# EAGLE design CubePCB_partitionedWithDIP (EAGLE 9.2.2)
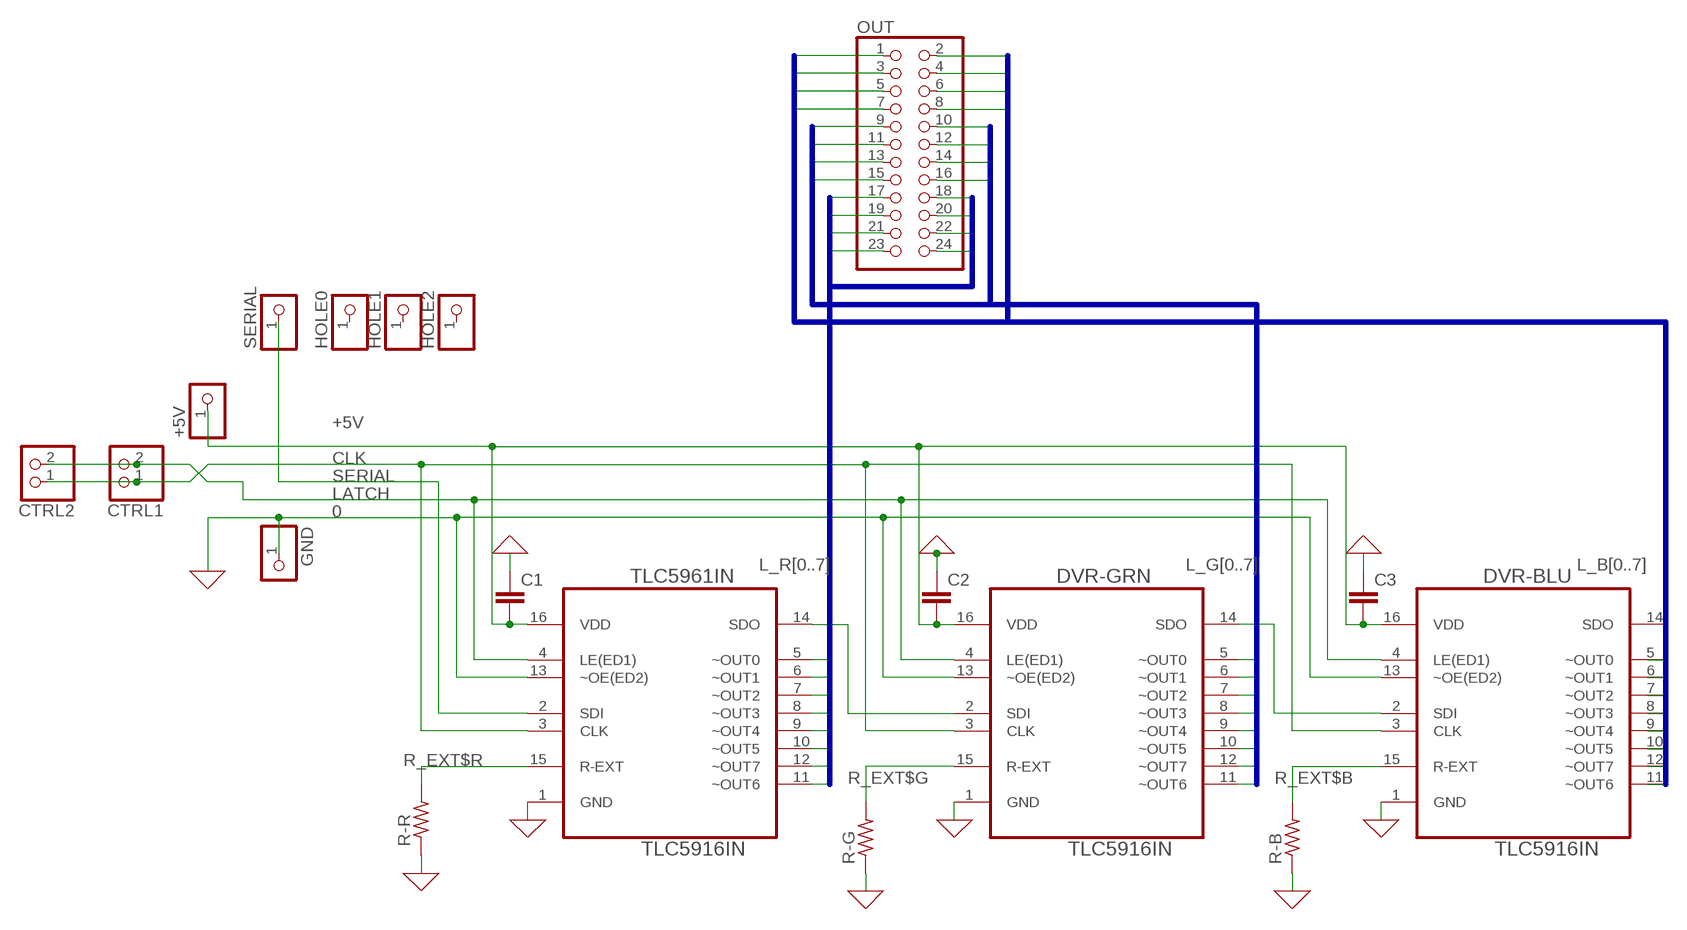
[diagram p0: schematic, sheet 1]

## Parts
+5V  PINHD-1X1  [1X01]
C1  C2,5-3  [C2.5-3]
C2  C2,5-3  [C2.5-3]
C3  C2,5-3  [C2.5-3]
CTRL1  PINHD-1X2  [1X02]
CTRL2  PINHD-1X2  [1X02]
DVR-BLU  TLC5916IN  [DIP254P762X508-16]
DVR-GRN  TLC5916IN  [DIP254P762X508-16]
GND  PINHD-1X1  [1X01]
HOLE0  PINHD-1X1  [1X01]
HOLE1  PINHD-1X1  [1X01]
HOLE2  PINHD-1X1  [1X01]
OUT  PINHD-2X12  [2X12]
R-B  R-US_0204/7  [0204/7]
R-G  R-US_0204/7  [0204/7]
R-R  R-US_0204/7  [0204/7]
SERIAL  PINHD-1X1  [1X01]
TLC5961IN  TLC5916IN  [DIP254P762X508-16]

## Nets
0: C1.1 C2.1 C3.1 DVR-BLU.1(GND) DVR-BLU.13(~OE(ED2)) DVR-GRN.1(GND) DVR-GRN.13(~OE(ED2)) GND.1 R-B.1 R-G.1 R-R.1 TLC5961IN.1(GND) TLC5961IN.13(~OE(ED2)) ; supply symbol labelled GND
+5V: +5V.1 C1.2 C2.2 C3.2 DVR-BLU.16(VDD) DVR-GRN.16(VDD) TLC5961IN.16(VDD)
CLK: CTRL1.1 CTRL2.1 DVR-BLU.3(CLK) DVR-GRN.3(CLK) TLC5961IN.3(CLK)
L_B0: DVR-BLU.5(~OUT0) OUT.7
L_B1: DVR-BLU.6(~OUT1) OUT.8
L_B2: DVR-BLU.7(~OUT2) OUT.5
L_B3: DVR-BLU.8(~OUT3) OUT.6
L_B4: DVR-BLU.9(~OUT4) OUT.3
L_B5: DVR-BLU.10(~OUT5) OUT.4
L_B6: DVR-BLU.12(~OUT7) OUT.1
L_B7: DVR-BLU.11(~OUT6) OUT.2
L_G0: DVR-GRN.5(~OUT0) OUT.15
L_G1: DVR-GRN.6(~OUT1) OUT.16
L_G2: DVR-GRN.7(~OUT2) OUT.13
L_G3: DVR-GRN.8(~OUT3) OUT.14
L_G4: DVR-GRN.9(~OUT4) OUT.11
L_G5: DVR-GRN.10(~OUT5) OUT.12
L_G6: DVR-GRN.12(~OUT7) OUT.9
L_G7: DVR-GRN.11(~OUT6) OUT.10
L_R0: OUT.23 TLC5961IN.5(~OUT0)
L_R1: OUT.24 TLC5961IN.6(~OUT1)
L_R2: OUT.21 TLC5961IN.7(~OUT2)
L_R3: OUT.22 TLC5961IN.8(~OUT3)
L_R4: OUT.19 TLC5961IN.9(~OUT4)
L_R5: OUT.20 TLC5961IN.10(~OUT5)
L_R6: OUT.17 TLC5961IN.12(~OUT7)
L_R7: OUT.18 TLC5961IN.11(~OUT6)
LATCH: CTRL1.2 CTRL2.2 DVR-BLU.4(LE(ED1)) DVR-GRN.4(LE(ED1)) TLC5961IN.4(LE(ED1))
N$1: DVR-GRN.2(SDI) TLC5961IN.14(SDO)
N$2: DVR-BLU.2(SDI) DVR-GRN.14(SDO)
R_EXT$B: DVR-BLU.15(R-EXT) R-B.2
R_EXT$G: DVR-GRN.15(R-EXT) R-G.2
R_EXT$R: R-R.2 TLC5961IN.15(R-EXT)
SERIAL: SERIAL.1 TLC5961IN.2(SDI)
Unconnected: DVR-BLU.14(SDO) HOLE0.1 HOLE1.1 HOLE2.1

## Buses
L_R[0..7]
L_G[0..7]
L_B[0..7]

## Library data of the parts
+5V GND HOLE0 HOLE1 HOLE2 SERIAL = pinhead:PINHD-1X1: PIN HEADER
C1-C3 = capacitor-wima:C: CAPACITOR naming: grid - package width
CTRL1 CTRL2 = pinhead:PINHD-1X2: PIN HEADER
DVR-BLU DVR-GRN TLC5961IN = Texas Instruments_By_element14_Batch_1:TLC5916IN: 8-CHANNEL CONSTANT-CURRENT LED SINK DRIVERS; MPN: TLC5916IN; OC_FARNELL: 1647814; OC_NEWARK: 60M1749; PACKAGE: PDIP-16; SUPPLIER: Texas Instruments
OUT = pinhead:PINHD-2X12: PIN HEADER
R-B R-G R-R = rcl:R-US_: RESISTOR, American symbol; SPICEPREFIX: R

## Module SLICE
Ports: +5V(io) SERIAL(io) CLK(io) LATCH(io) 0(io) ~OUT_EN(io)

### Library data of the parts

## Board
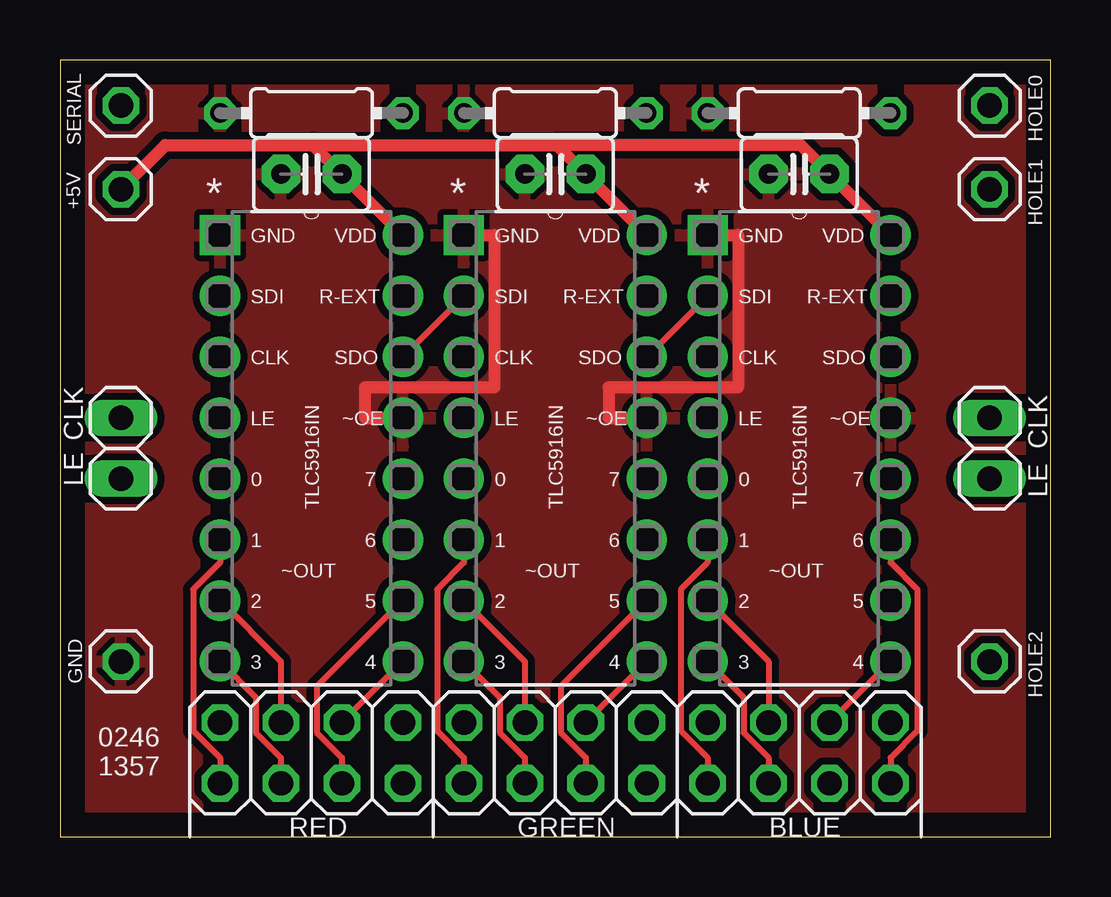
[diagram p1: board, top side]
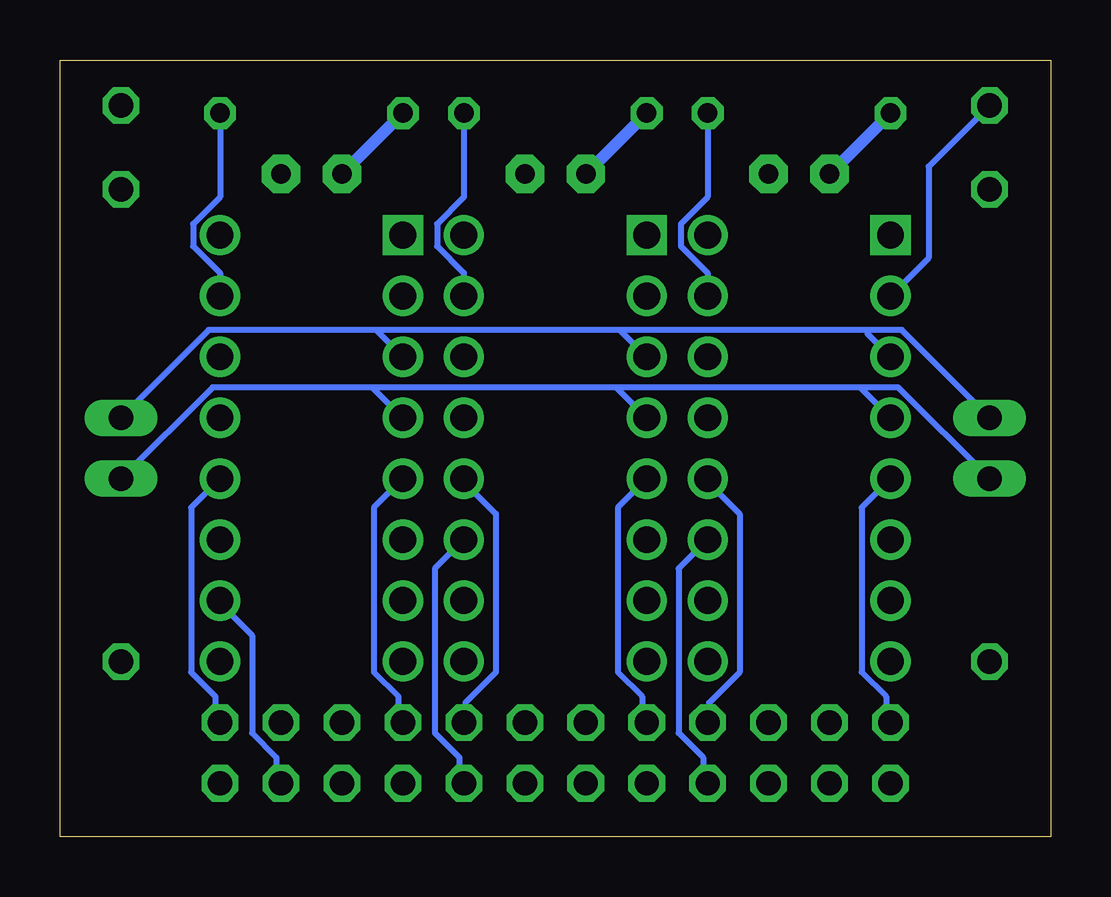
[diagram p2: board, bottom side, seen from below]

Size 41.27 x 32.38 mm. Coordinates in mm from the lower left corner, seen from the top.
Outline: 0,0 41.27,0.01 41.27,32.38 0,32.38 0,0
Copper layers (1*16): Top 0.035mm / dielectric 1.5mm / Bottom 0.035mm
Design rules "default *": minimum track width 10mil, minimum drill 0.35mm, track to track 10mil, track to pad 6mil, pad to pad 6mil, via to via 6mil, smd to smd 6mil, copper to edge 40mil, drill to drill 6mil, minimum pad ring 10mil, minimum via ring 8mil, stop-mask expansion 4mil, vias tented up to drill 0mil, thermal gap 10mil

### Footprints (pad centres in the part's own frame; a part is rotated, then mirrored left to right if it is on the bottom)
1X01 = drill 1.016 octagon: 1 0,0
C2.5-3 = drill 0.813 pad 1.6 octagon: 1 -1.27,0; 2 1.27,0
1X02 = drill 1.016 long: 1 -1.27,0; 2 1.27,0
DIP254P762X508-16 = drill 1.118 square: 1 -7.62,17.78 | drill 1.118: 2 -7.62,15.24; 3 -7.62,12.7; 4 -7.62,10.16; 5 -7.62,7.62; 6 -7.62,5.08; 7 -7.62,2.54; 8 -7.62,0; 9 0,0; 10 0,2.54; 11 0,5.08; 12 0,7.62; 13 0,10.16; 14 0,12.7; 15 0,15.24; 16 0,17.78
2X12 = drill 1.016 octagon: 1 -13.97,-1.27; 2 -13.97,1.27; 3 -11.43,-1.27; 4 -11.43,1.27; 5 -8.89,-1.27; 6 -8.89,1.27; 7 -6.35,-1.27; 8 -6.35,1.27; 9 -3.81,-1.27; 10 -3.81,1.27; 11 -1.27,-1.27; 12 -1.27,1.27; 13 1.27,-1.27; 14 1.27,1.27; 15 3.81,-1.27; 16 3.81,1.27; 17 6.35,-1.27; 18 6.35,1.27; 19 8.89,-1.27; 20 8.89,1.27; 21 11.43,-1.27; 22 11.43,1.27; 23 13.97,-1.27; 24 13.97,1.27
0204/7 = drill 0.813 octagon: 1 -3.81,0; 2 3.81,0

### Placement (x,y rotation side)
+5V  2.54,26.99 0 top
C1  10.48,27.62 0 top
C2  20.64,27.62 0 top
C3  30.8,27.62 0 top
CTRL1  2.54,16.19 270 top
CTRL2  38.73,16.19 270 top
DVR-BLU  34.61,7.3 0 top
DVR-GRN  24.45,7.3 0 top
GND  2.54,7.3 0 top
HOLE0  38.73,30.48 0 top
HOLE1  38.73,26.99 0 top
HOLE2  38.73,7.3 0 top
OUT  20.64,3.49 180 top
R-B  30.8,30.16 0 top
R-G  20.64,30.16 0 top
R-R  10.48,30.16 0 top
SERIAL  2.54,30.48 0 top
TLC5961IN  14.29,7.3 0 top

### Tracks (layer width: path | path; a pad name or v marks a point on that pad's centre or on a via)
0
  Top 0.508: TLC5961IN.13 12.7,17.46 12.7,18.73 18.1,18.73 18.1,25.08 DVR-GRN.1 | DVR-GRN.13 22.86,17.46 22.86,18.73 28.26,18.73 28.26,25.08 DVR-BLU.1
  Bottom 0.508: R-R.1 C1.1 | R-G.1 C2.1 | C3.1 R-B.1
  pour Top (isolate 0.305): 0,0 0,32.38 41.27,32.38 41.27,0
+5V
  Top 0.508: TLC5961IN.16 C1.2 10.54,28.83 | DVR-GRN.16 C2.2 20.7,28.83 | DVR-BLU.16 C3.2 30.86,28.83 20.7,28.83 | 10.54,28.83 4.38,28.83 +5V.1 | 10.54,28.83 20.7,28.83
CLK
  Bottom 0.254: 7.62,21.12 6.2,21.12 CTRL1.1 | 7.62,21.12 17.95,21.12 | 17.95,21.12 28.11,21.12 | CTRL2.1 35.08,21.12 28.26,21.12 28.11,21.12 | TLC5961IN.3 7.62,20.95 7.62,21.12 | DVR-GRN.3 17.95,21.12 | DVR-BLU.3 28.11,21.12
L_B0
  Bottom 0.254: DVR-BLU.5 28.19,13.72 28.19,6.86 27.18,5.84 27.18,4.83 OUT.7
L_B1
  Top 0.254: DVR-BLU.6 26.99,11.42 25.87,10.3 25.87,4.41 26.99,3.29 OUT.8
L_B2
  Top 0.254: DVR-BLU.7 29.53,7.3 OUT.5
L_B3
  Top 0.254: DVR-BLU.8 28.49,5.8 28.49,4.33 29.53,3.29 OUT.6
L_B4
  Top 0.254: OUT.3 DVR-BLU.9
L_B5
  Bottom 0.254: OUT.4 32.26,2.29 32.26,3.3 33.27,4.32 33.27,8.38 34.54,9.65 DVR-BLU.10
L_B6
  Bottom 0.254: DVR-BLU.12 35.81,13.72 35.81,6.86 34.8,5.84 34.8,4.83 OUT.1
L_B7
  Top 0.254: DVR-BLU.11 34.61,11.42 35.73,10.3 35.73,4.41 34.61,3.29 OUT.2
L_G0
  Bottom 0.254: DVR-GRN.5 18.03,13.72 18.03,6.86 17.02,5.84 17.02,4.83 OUT.15
L_G1
  Top 0.254: DVR-GRN.6 16.83,11.42 15.71,10.3 15.71,4.41 16.83,3.29 OUT.16
L_G2
  Top 0.254: DVR-GRN.7 19.37,7.3 OUT.13
L_G3
  Top 0.254: DVR-GRN.8 18.33,5.8 18.33,4.33 19.37,3.29 OUT.14
L_G4
  Top 0.254: DVR-GRN.9 OUT.11
L_G5
  Top 0.254: OUT.12 21.91,3.29 20.87,4.33 20.87,6.26 DVR-GRN.10
L_G6
  Bottom 0.254: OUT.9 24.38,4.83 24.38,5.59 23.11,6.86 23.11,13.46 24.38,14.73 DVR-GRN.12
L_G7
  Bottom 0.254: DVR-GRN.11 25.65,11.18 25.65,4.32 24.64,3.3 24.64,2.29 OUT.10
L_R0
  Bottom 0.254: TLC5961IN.5 7.87,13.72 7.87,6.86 6.86,5.84 6.86,4.83 OUT.23
L_R1
  Top 0.254: TLC5961IN.6 6.67,11.42 5.55,10.3 5.55,4.41 6.67,3.29 OUT.24
L_R2
  Top 0.254: TLC5961IN.7 9.21,7.3 OUT.21
L_R3
  Top 0.254: TLC5961IN.8 8.17,5.8 8.17,4.33 9.21,3.29 OUT.22
L_R4
  Top 0.254: TLC5961IN.9 OUT.19
L_R5
  Top 0.254: OUT.20 11.75,3.29 10.71,4.33 10.71,6.26 TLC5961IN.10
L_R6
  Bottom 0.254: OUT.17 14.22,4.83 14.22,5.59 12.95,6.86 12.95,13.46 14.22,14.73 TLC5961IN.12
L_R7
  Bottom 0.254: TLC5961IN.11 15.49,11.18 15.49,4.32 14.48,3.3 14.48,2.29 OUT.18
LATCH
  Bottom 0.254: 7.94,18.73 6.35,18.73 CTRL1.2 | 7.94,18.73 18.1,18.73 | 18.1,18.73 28.26,18.73 | 28.26,18.73 34.92,18.73 CTRL2.2 | TLC5961IN.4 7.94,18.73 | DVR-GRN.4 18.1,18.73 | DVR-BLU.4 28.26,18.73
N$1
  Top 0.254: TLC5961IN.14 DVR-GRN.2
N$2
  Top 0.254: DVR-GRN.14 DVR-BLU.2
R_EXT$B
  Bottom 0.254: R-B.2 34.61,26.66 35.73,25.55 35.73,24.62 34.61,23.5 DVR-BLU.15
R_EXT$G
  Bottom 0.254: R-G.2 24.45,26.66 25.57,25.55 25.57,24.62 24.45,23.5 DVR-GRN.15
R_EXT$R
  Bottom 0.254: R-R.2 14.29,26.66 15.4,25.55 15.4,24.62 14.29,23.5 TLC5961IN.15
SERIAL
  Bottom 0.254: SERIAL.1 5.08,27.94 5.08,24.13 TLC5961IN.2

### Text on the board
tPlace: GND | VDD | GND | VDD | GND | VDD | SDI | R-EXT | SDI | R-EXT | SDI | R-EXT | CLK | SDO | CLK | SDO | CLK | SDO | CLK | CLK | LE | ~OE | LE | ~OE | LE | ~OE | LE | LE | 0 | 7 | 0 | 7 | 0 | 7 | TLC5916IN | TLC5916IN | TLC5916IN | 1 | 6 | 1 | 6 | 1 | 6 | ~OUT | ~OUT | ~OUT | 2 | 5 | 2 | 5 | 2 | 5 | 3 | 4 | 3 | 4 | 3 | 4 | 0246 / 1357 | RED | GREEN | BLUE